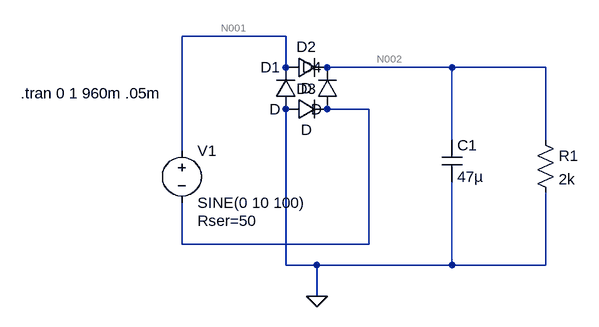
[diagram p0: schematic secondo es prelab.asc]
secondo es prelab.asc, the LTspice schematic file:
Version 4
SHEET 1 880 680
WIRE 192 -64 32 -64
WIRE 192 -16 192 -64
WIRE 448 -16 256 -16
WIRE 592 -16 448 -16
WIRE 320 48 256 48
WIRE 448 96 448 -16
WIRE 592 96 592 -16
WIRE 32 112 32 -64
WIRE 32 256 32 192
WIRE 320 256 320 48
WIRE 320 256 32 256
WIRE 192 288 192 48
WIRE 240 288 192 288
WIRE 448 288 448 160
WIRE 448 288 240 288
WIRE 592 288 592 176
WIRE 592 288 448 288
WIRE 240 336 240 288
FLAG 240 336 0
SYMBOL voltage 32 96 R0
WINDOW 123 0 0 Left 0
WINDOW 39 24 124 Left 2
SYMATTR SpiceLine Rser=50
SYMATTR InstName V1
SYMATTR Value SINE(0 10 100)
SYMBOL diode 208 48 R180
WINDOW 0 24 64 Left 2
WINDOW 3 24 0 Left 2
SYMATTR InstName D1
SYMBOL diode 192 0 R270
WINDOW 0 32 32 VTop 2
WINDOW 3 0 32 VBottom 2
SYMATTR InstName D2
SYMBOL diode 192 64 R270
WINDOW 0 32 32 VTop 2
WINDOW 3 0 32 VBottom 2
SYMATTR InstName D3
SYMBOL diode 272 48 R180
WINDOW 0 24 64 Left 2
WINDOW 3 24 0 Left 2
SYMATTR InstName D4
SYMBOL cap 432 96 R0
SYMATTR InstName C1
SYMATTR Value 47µ
SYMBOL res 576 80 R0
SYMATTR InstName R1
SYMATTR Value 2k
TEXT -216 24 Left 2 !.tran 0 1 960m .05m

The netlist it stands for:
* secondo es prelab.asc
V1 N001 N003 SINE(0 10 100) Rser=50
D1 0 N001 D
D2 N001 N002 D
D3 0 N003 D
D4 N003 N002 D
C1 N002 0 47µ
R1 N002 0 2k
.model D D
.lib standard.dio
.tran 0 1 960m .05m
.backanno
.end

* Results of the author's LTspice run, read from the files saved beside the schematic
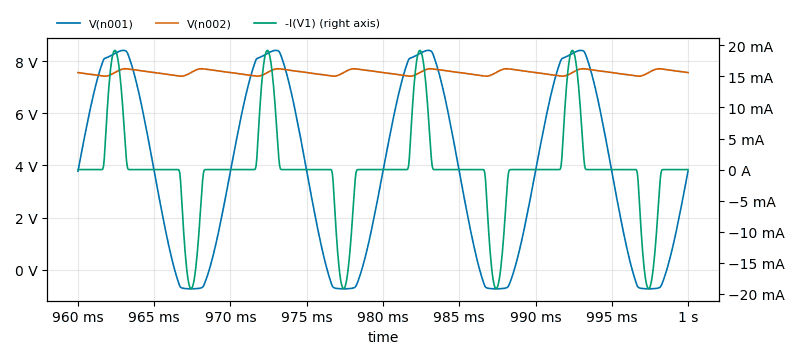
[diagram p1: Transient Analysis of secondo es prelab.asc, plotted from the saved traces]
* Transient Analysis, 1 run:
*   V(n001): min -731.6 mV, max 8.412 V, average 3.783 V, rms 5.097 V, last 3.78 V
*   V(n002): min 7.422 V, max 7.707 V, average 7.565 V, rms 7.566 V, last 7.559 V
*   -I(V1): min -19.19 mA, max 19.19 mA, average 0 A, rms 7.563 mA, last 0 A